# Altium schematic sheet Sheet6.SchDoc
size A3; DocumentNumber: 6; SheetNumber: 6; SheetTotal: 7
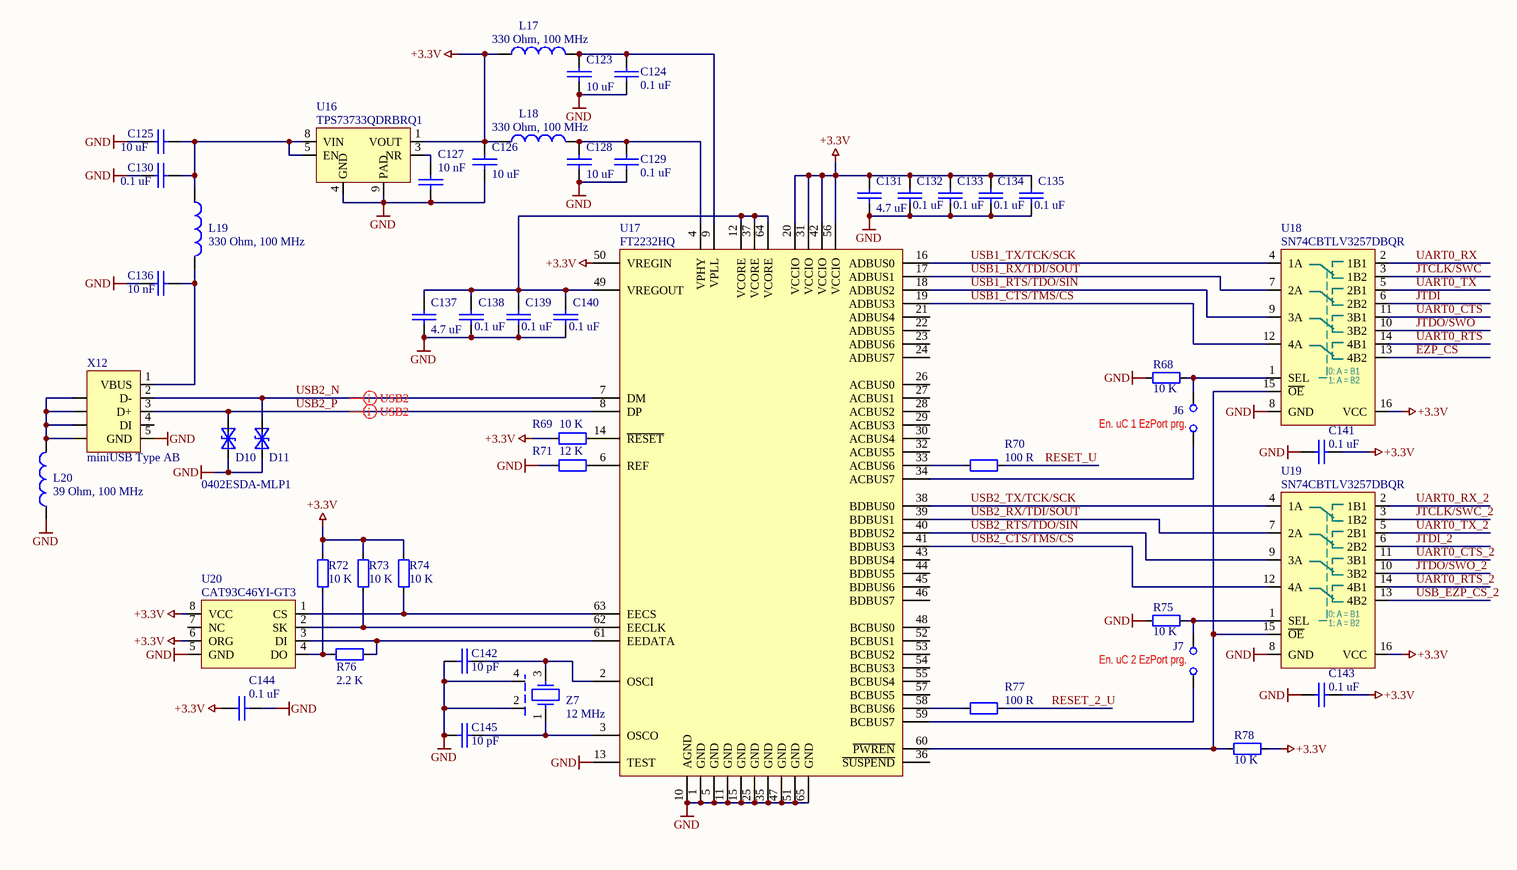
[diagram p0: Sheet6.SchDoc]

## Parts
C123  value 10 uF  [2012[0805]]  (hidden comment: C2012X5R1C106K085AC)
C124  value 0.1 uF  [1005[0402]]  (hidden comment: CL10B104KA8NNND)
C125  value 10 uF  [2012[0805]]  (hidden comment: C2012X5R1C106K085AC)
C126  value 10 uF  [2012[0805]]  (hidden comment: C2012X5R1C106K085AC)
C127  value 10 nF  [1005[0402]]  (hidden comment: CL05B103KB5NNNC)
C128  value 10 uF  [2012[0805]]  (hidden comment: C2012X5R1C106K085AC)
C129  value 0.1 uF  [1005[0402]]  (hidden comment: CL10B104KA8NNND)
C130  value 0.1 uF  [1608[0603]]  (hidden comment: CL10B104KA8NNND)
C131  value 4.7 uF  [1608[0603]]  (hidden comment: LMK107BJ475KA-T)
C132  value 0.1 uF  [1005[0402]]  (hidden comment: CL10B104KA8NNND)
C133  value 0.1 uF  [1005[0402]]  (hidden comment: CL10B104KA8NNND)
C134  value 0.1 uF  [1005[0402]]  (hidden comment: CL10B104KA8NNND)
C135  value 0.1 uF  [1005[0402]]  (hidden comment: CL10B104KA8NNND)
C136  value 10 nF  [1608[0603]]  (hidden comment: CL10B103JB8NNNC)
C137  value 4.7 uF  [1608[0603]]  (hidden comment: LMK107BJ475KA-T)
C138  value 0.1 uF  [1005[0402]]  (hidden comment: CL10B104KA8NNND)
C139  value 0.1 uF  [1005[0402]]  (hidden comment: CL10B104KA8NNND)
C140  value 0.1 uF  [1005[0402]]  (hidden comment: CL10B104KA8NNND)
C141  value 0.1 uF  [1005[0402]]  (hidden comment: CL10B104KA8NNND)
C142  value 10 pF  [1608[0603]]  (hidden comment: CCPF010K0603)
C143  value 0.1 uF  [1005[0402]]  (hidden comment: CL10B104KA8NNND)
C144  value 0.1 uF  [1005[0402]]  (hidden comment: CL10B104KA8NNND)
C145  value 10 pF  [1608[0603]]  (hidden comment: CCPF010K0603)
D10  0402ESDA-MLP1  [0402]  (value not drawn)
D11  0402ESDA-MLP1  [0402]
J6  PH1-02-TA-HT  [HDR1X2V]  (value not drawn)
J7  PH1-02-TA-HT  [HDR1X2V]  (value not drawn)
L17  value 330 Ohm, 100 MHz  [0603]  (hidden comment: BLM18SG331TN1D)
L18  value 330 Ohm, 100 MHz  [0603]  (hidden comment: BLM18SG331TN1D)
L19  value 330 Ohm, 100 MHz  [0603]  (hidden comment: BLM18SG331TN1D)
L20  value 39 Ohm, 100 MHz  [0805]  (hidden comment: EXC-ML20A390U)
R68  value 10 K  [0603]  (hidden comment: ERJ-3EKF1002V)
R69  value 10 K  [0603]  (hidden comment: ERJ-3EKF1002V)
R70  value 100 R  [0603]  (hidden comment: ERJ-3EKF1000V)
R71  value 12 K  [0603]  (hidden comment: RC0603FR-0712KL)
R72  value 10 K  [0603]  (hidden comment: ERJ-3EKF1002V)
R73  value 10 K  [0603]  (hidden comment: ERJ-3EKF1002V)
R74  value 10 K  [0603]  (hidden comment: ERJ-3EKF1002V)
R75  value 10 K  [0603]  (hidden comment: ERJ-3EKF1002V)
R76  value 2.2 K  [0603]  (hidden comment: RC0603FR-072K2L)
R77  value 100 R  [0603]  (hidden comment: ERJ-3EKF1000V)
R78  value 10 K  [0603]  (hidden comment: ERJ-3EKF1002V)
U16  TPS73733QDRBRQ1  [TI DRB (S-PVSON-N8)]
U17  FT2232HQ  [QFN-64]
U18  SN74CBTLV3257DBQR  [TI DBQ 16pin (R-PDSO-G16)]
U19  SN74CBTLV3257DBQR  [TI DBQ 16pin (R-PDSO-G16)]
U20  CAT93C46YI-GT3  [TSSOP-8]
X12  miniUSB Type AB  [USB AB 56579-0576 Molex]
Z7  value 12 MHz  [DSX321G]  (hidden comment: NX3225SA-12.000MHZ-STD-CSR-1)

## Nets
+3.3V: C126.1 C131.2 C132.2 C133.2 C134.2 C135.2 C141.1 C143.1 C144.2 L17.1 L18.1 R69.2 R72.2 R73.2 R74.2 R78.2 U16.1(VOUT) U17.20(VCCIO) U17.31(VCCIO) U17.42(VCCIO) U17.50(VREGIN) U17.56(VCCIO) U18.16(VCC) U19.16(VCC) U20.6(ORG) U20.8(VCC)
GND: C123.2 C124.1 C125.1 C126.2 C127.2 C128.2 C129.1 C130.2 C131.1 C132.1 C133.1 C134.1 C135.1 C136.2 C137.1 C138.1 C139.1 C140.1 C141.2 C142.2 C143.2 C144.1 C145.2 D10.1(C) D11.1(C) L20.1 R68.1 R71.1 R75.1 U16.4(GND) U16.9(PAD) U17.1(GND) U17.5(GND) U17.10(AGND) U17.11(GND) U17.13(TEST) U17.15(GND) U17.25(GND) U17.35(GND) U17.47(GND) U17.51(GND) U17.65(GND) U18.8(GND) U19.8(GND) U20.5(GND) X12.5(GND) Z7.2 Z7.4
EZP_CS: U18.13(4B2)
JTCLK/SWC: U18.3(1B2)
JTCLK/SWC_2: U19.3(1B2)
JTDI: U18.6(2B2)
JTDI_2: U19.6(2B2)
JTDO/SWO: U18.10(3B2)
JTDO/SWO_2: U19.10(3B2)
RESET_2_U: R77.1
RESET_U: R70.1
UART0_CTS: U18.11(3B1)
UART0_CTS_2: U19.11(3B1)
UART0_RTS: U18.14(4B1)
UART0_RTS_2: U19.14(4B1)
UART0_RX: U18.2(1B1)
UART0_RX_2: U19.2(1B1)
UART0_TX: U18.5(2B1)
UART0_TX_2: U19.5(2B1)
USB1_CTS/TMS/CS: U17.19(ADBUS3) U18.12(4A)
USB1_RTS/TDO/SIN: U17.18(ADBUS2) U18.9(3A)
USB1_RX/TDI/SOUT: U17.17(ADBUS1) U18.7(2A)
USB1_TX/TCK/SCK: U17.16(ADBUS0) U18.4(1A)
USB2_CTS/TMS/CS: U17.41(BDBUS3) U19.12(4A)
USB2_N: D11.2(A) U17.7(DM) X12.2(D-)
USB2_P: D10.2(A) U17.8(DP) X12.3(D+)
USB2_RTS/TDO/SIN: U17.40(BDBUS2) U19.9(3A)
USB2_RX/TDI/SOUT: U17.39(BDBUS1) U19.7(2A)
USB2_TX/TCK/SCK: U17.38(BDBUS0) U19.4(1A)
USB_EZP_CS_2: U19.13(4B2)
NetC123_1: C123.1 C124.2 L17.2 U17.9(VPLL)
NetC125_2: C125.2 C130.1 L19.1 U16.5(EN) U16.8(VIN)
NetC127_1: C127.1 U16.3(NR)
NetC128_1: C128.1 C129.2 L18.2 U17.4(VPHY)
NetC136_1: C136.1 L19.2 X12.1(VBUS)
NetC137_2: C137.2 C138.2 C139.2 C140.2 U17.12(VCORE) U17.37(VCORE) U17.49(VREGOUT) U17.64(VCORE)
NetC142_1: C142.1 U17.2(OSCI) Z7.3
NetC145_1: C145.1 U17.3(OSCO) Z7.1
NetJ6_1: J6.1 R68.2 U18.1(SEL)
NetJ6_2: J6.2 U17.34(ACBUS7)
NetJ7_1: J7.1 R75.2 U19.1(SEL)
NetJ7_2: J7.2 U17.59(BCBUS7)
NetL20_2: L20.2 X12.S1(SHLD) X12.S2(SHLD) X12.S3(SHLD) X12.S4(SHLD)
NetR69_1: R69.1 U17.14(~{RESET})
NetR70_2: R70.2 U17.33(ACBUS6)
NetR71_2: R71.2 U17.6(REF)
NetR72_1: R72.1 R76.2 U20.4(DO)
NetR73_1: R73.1 U17.62(EECLK) U20.2(SK)
NetR74_1: R74.1 U17.63(EECS) U20.1(CS)
NetR76_1: R76.1 U17.61(EEDATA) U20.3(DI)
NetR77_2: R77.2 U17.58(BCBUS6)
NetR78_1: R78.1 U17.60(~{PWREN}) U18.15(~{OE}) U19.15(~{OE})

Not connected (* = marked no-connect by the designer): U17 21(ADBUS4) 22(ADBUS5) 23(ADBUS6) 24(ADBUS7) 26(ACBUS0) 27(ACBUS1) 28(ACBUS2) 29(ACBUS3) 30(ACBUS4) 32(ACBUS5) 36(~{SUSPEND}) 43(BDBUS4) 44(BDBUS5) 45(BDBUS6) 46(BDBUS7) 48(BCBUS0) 52(BCBUS1) 53(BCBUS2) 54(BCBUS3) 55(BCBUS4) 57(BCBUS5); U20 7(NC); X12 4(DI)

## Layout directives
differential pair: USB2_N, USB2_P

## Notes on the sheet
- (near J6) En. uC 1 EzPort prg.
- (near J7) En. uC 2 EzPort prg.
- (in symbol SN74CBTLV3257DBQR) 0: A = B1; 1: A = B2

## Library data of the parts
C123 C125 C126 C128 = C2012X5R1C106K/0.85: 10 uF, 16V, X5R, ±10%, 0805; Manufacturer: TDK Corporation; Distributor: Future; Price: 0.0347 Euro; Tolerance: ±10%; PartNum: C2012X5R1C106K085AC; Voltage: 16V; PartName: C2012X5R1C106K085AC; Price50: 0.0347 Euro; Price100: 0.0347 Euro; Price1000: 0.0347 Euro
C124 C129 C132-C135 C138-C141 C143 C144 = GRM155R71C104KA88D: 0.1 uF, 16V, 10%, X7R, 0402; Manufacturer: Murata; PartNum: 490-3261-1-ND; Tolerance: 10%; Distributor: Digi-Key; Price: 0.005$; Voltage: 16 V
C127 = GRM155R71C103KA01D_1: 10 nF, 16V, 10%, X7R, 0402; Manufacturer: SAMSUNG; Tolerance: 10%; Distributor: Future; Price: 0.02$; PartNum: CL05B103KB5NNNC; Voltage: 16 V; PartName: CL05B103KB5NNNC
C130 = CVNF100K0603-25: 0.1 uF, 25V, 10% , X7R,  0603 SMD MLC Capacitor; Manufacturer: SAMSUNG; Tolerance: 10%; Distributor: Future; Price: 0.0026 Euro; Voltage: 25 V; PartNum: CL10B104KA8NNND; PartName: CL10B104KA8NNND; Price50: 0.0026 Euro; Price100: 0.0026 Euro; Price1000: 0.0026 Euro
C131 C137 = LMK107BJ475KA-T: 4.7 uF, 10V, 10%, X5R, 0603; Manufacturer: Taiyo Yuden; PartNum: 587-1441-1-ND; Tolerance: +-10%; Distributor: Digi-Key; Price: 0.23$; PartName: LMK107BJ475KA-T; Voltage: 10 V
C136 = CVNF010K0603: 10 nF, 50V, 5%, X7R, 0603 SMD MLC Capacitor; Manufacturer: SAMSUNG; Tolerance: 5%; Distributor: Future; Price: 0.0045 Euro; PartNum: CL10B103JB8NNNC; Voltage: 50 V; PartName: CL10B103JB8NNNC; Price50: 0.0045 Euro; Price100: 0.0045 Euro; Price1000: 0.0045 Euro
C142 C145 = CCPF010K0603: 10 pF, 50V, 5%, NP0, 0603 SMD MLC Capacitor; Manufacturer: Kemet; PartNum: 399-1049-1-ND; PartName: C0603C100J5GACTU; Tolerance: 5%; Price: 0.0075$; Distributor: Digi-Key; Voltage: 50 V
D10 D11 = 0402ESDA-MLP1: SUPPRESSOR ESD 30VDC 0402 HFREE; Manufacturer: Cooper Bussmann; PartNum: 283-2964-2-ND; Voltage: 30V; Distributor: Digi-Key; Price: 0.087$; PartName: 0402ESDA-MLP1
J6 J7 = Jumper: 2 Pos. 2.54 mm Single Row Through Hole Straight Pin Header; Manufacturer: ADAM TECH; Distributor: Future; Price: 0.02 Euro; PartNum: PH1-02-TA-HT; PartName: PH1-02-TA-HT; Price50: 0.02 Euro; Price100: 0.02 Euro; Price1000: 0.02 Euro
L17-L19 = BLM18SG331TN1D: Ferrite bead, 330 Ohm, 100 MHz,  1.5 A, 0.07 Ohm; Manufacturer: Murata Electronics North America; Tolerance: 25%; Distributor: Future; Price: 0.03 Euro; PartNum: BLM18SG331TN1D; PartName: BLM18SG331TN1D; Price50: 0.03 Euro; Price100: 0.03 Euro; Price1000: 0.03 Euro
L20 = EXC-ML20A390U: Ferrite bead, 39 Ohm, 100 MHz,  4 A; Manufacturer: Panasonic - ECG; PartNum: P10191TR-ND; Ordered: Digi-Key; Distributor: Digi-Key; Price: 0.21$; PartName: EXC-ML20A390U; Price50: 0.17$; Price100: 0.15$; Price1000: 0.1$
R68 R69 R72-R75 R78 = RL0603K010-1: 10 K, 1%, 0603, SMD Resistor, Taped; Manufacturer: PANASONIC; Voltage: 75 V; Distributor: Future; Price: 0.0015 Euro; Tolerance: 1%; PartNum: ERJ-3EKF1002V; PartName: ERJ-3EKF1002V; Price50: 0.0015 Euro; Price100: 0.0015 Euro; Price1000: 0.0015 Euro
R70 R77 = RL0603E100-1: 100 R, 1%, 0603, SMD Resistor, Taped; Manufacturer: PANASONIC; Voltage: 75 V; Distributor: Future; Price: 0.0017$; Tolerance: 1%; PartNum: ERJ-3EKF1000V; PartName: ERJ-3EKF1000V; Price50: 0.0015 Euro; Price100: 0.0015 Euro; Price1000: 0.0015 Euro
R71 = RL0603K012-1_1: 12 K, 1%, 0603, SMD Resistor, Taped; Manufacturer: YAGEO AMERICA CORPORATION; Voltage: 75 V; Distributor: Farnell; Price: 0.0017$; Tolerance: 1%; PartNum: RC0603FR-0712KL; PartName: RC0603FR-0712KL; Price50: 0.0017$; Price100: 0.0017$; Price1000: 0.0017$
R76 = RL0603K002.2-1_1: 2.2 K, 1%, 0603, SMD Resistor, Taped; Manufacturer: YAGEO AMERICA CORPORATION; Voltage: 75 V; Distributor: Future; Price: 0.0017$; Tolerance: 1%; PartNum: RC0603FR-072K2L; PartName: RC0603FR-072K2L; Price50: 0.0017$; Price100: 0.0017$; Price1000: 0.0017$
U16 = TPS73733QDRBRQ1: LDO 3.3V 1A , up to 5.5 V, -40..125C,  8-SON; Manufacturer: Texas Instruments; PartNum: 296-24157-1-ND; Price: 2$; Distributor: Digi-Key; PartName: TPS73733QDRBRQ1
U17 = FT2232HQ: Dual High Speed USB to Multipurpose UART/FIFO; Manufacturer: FTDI, Future Technology Devices International Ltd; PartNum: 768-1024-1-ND; Distributor: Dighi-Key; PartName: FT2232HQ; Price: 6.2$
U18 U19 = SN74CBTLV3257DBQR: LV DUAL FET MUX/DEMUX, 2.3..3.6V,  -40..85 C, 16SSOP; Manufacturer: Texas Instruments; PartNum: 296-9135-1-ND; Price: 0.95$; Distributor: Digi-Key; PartName: SN74CBTLV3257DBQR
U20 = CAT93C46YI-GT3: EEPROM 1KBIT 2MHZ 8TSSOP, -40..85 C; Manufacturer: ON Semiconductor; PartNum: CAT93C46YI-GT3OSCT-ND; Price: 0.4$; Distributor: DigiKey; PartName: CAT93C46YI-GT3
X12 = USB AB 56579-0576: SMD USB - OTG, miniUSB Type AB; Manufacturer: Molex/Waldom Electronics Corp; PartNum: WM17122CT-ND; Ordered: Digi-Key; Distributor: Digi-Key; Price: 2.81$; PartName: miniUSB Type AB; Price50: 2.43$; Price100: 1.83$; Price1000: 1.62$
Z7 = NX3225SA-12.000MHZ-STD-CSR-1: 12 MHz, 8 pF, ±15ppm, -10...+75 С; Manufacturer: NDK; PartNum: 644-1047-1-ND; Price: 1$; Distributor: Digi-Key; Tolerance: 15 ppm; PartName: NX3225SA-12.000MHZ-STD-CSR-1